# Altium schematic sheet 08_Power_Supply.SchDoc
size A; SheetNumber: 8; SheetTotal: 8
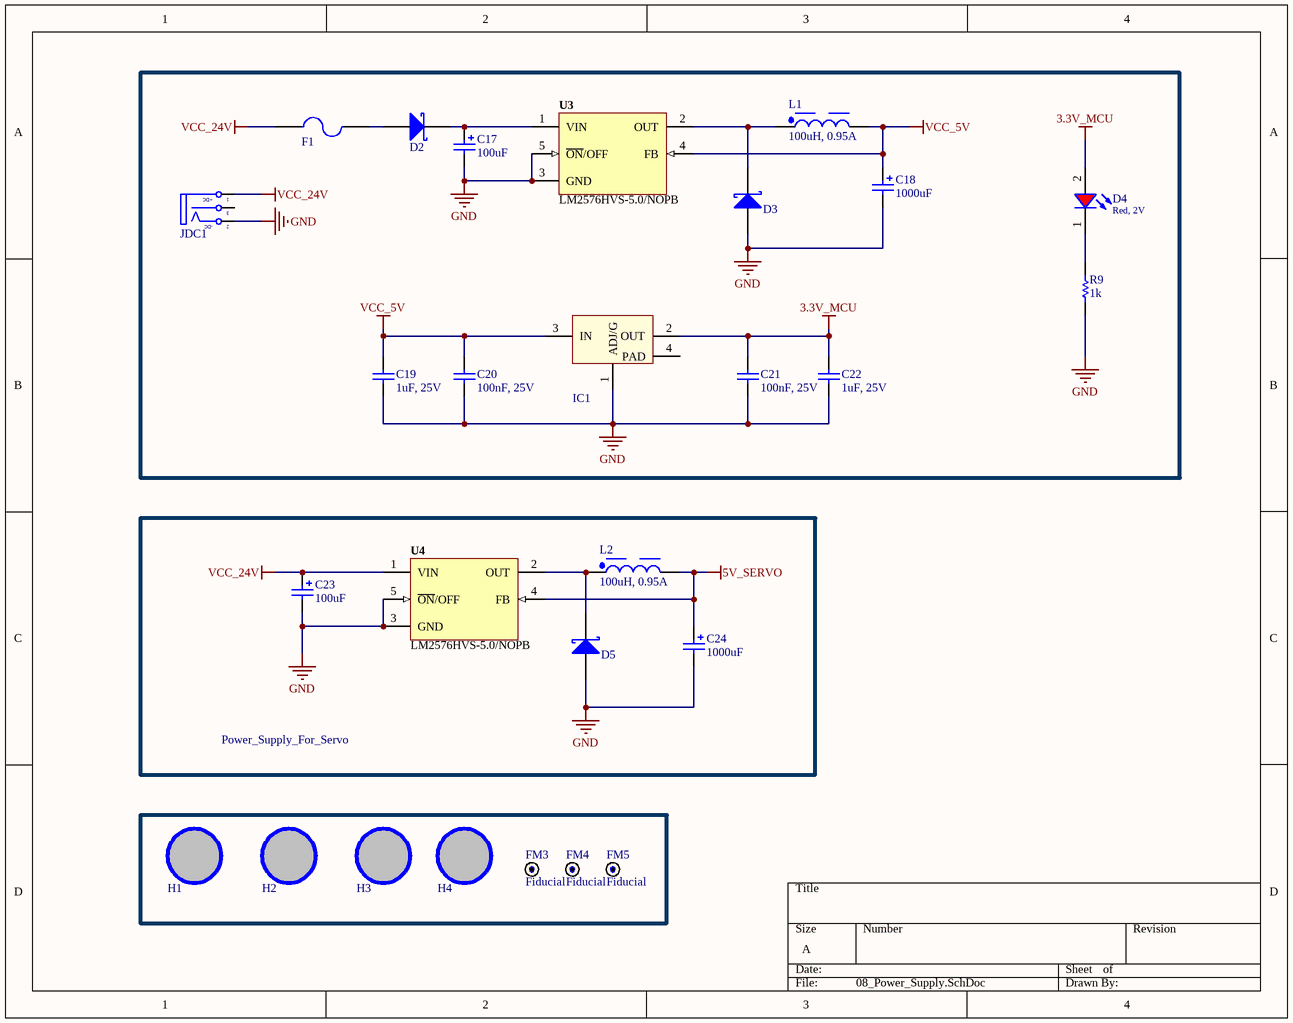
[diagram p0: 08_Power_Supply.SchDoc]

## Parts
C17  100uF  [WCAP-ATG8_D6.3H11]
C18  1000uF  [WCAP-ATG8_D10H20]
C19  1uF, 25V  [WCAP-CSGP_0603_H=0.8mm_Reflow]
C20  100nF, 25V  [WCAP-CSGP_0603_H=0.8mm_Reflow]
C21  100nF, 25V  [WCAP-CSGP_0603_H=0.8mm_Reflow]
C22  1uF, 25V  [WCAP-CSGP_0603_H=0.8mm_Reflow]
C23  100uF  [WCAP-ATG8_D6.3H11]
C24  1000uF  [WCAP-ATG8_D10H20]
D2  SS34  [SS34]  (value not drawn)
D3  SS34  [SS34]  (value not drawn)
D4  Red, 2V  [WL-SMCW_0603_H=0.7mm]
D5  SS34  [SS34]  (value not drawn)
F1  0ZCG0150BF2C  [FUSE SMD]  (value not drawn)
FM3  Fiducial  [FUDICIAL_MARKER]  (no BOM)
FM4  Fiducial  [FUDICIAL_MARKER]  (no BOM)
FM5  Fiducial  [FUDICIAL_MARKER]  (no BOM)
H1  Hole  [LO KHOAN 3MM]  (value not drawn)  (no BOM)
H2  Hole  [LO KHOAN 3MM]  (value not drawn)  (no BOM)
H3  Hole  [LO KHOAN 3MM]  (value not drawn)  (no BOM)
H4  Hole  [LO KHOAN 3MM]  (value not drawn)  (no BOM)
IC1  LM1117IMP-3.3/NOPB  [SOT223-4N]  (value not drawn)
JDC1  G-014-4  [DC-IN]  (value not drawn)
L1  100uH, 0.95A  [WE-PD2SR_7850]
L2  100uH, 0.95A  [WE-PD2SR_7850]
R9  value 1k  [RES-SM-0603]  (hidden comment: ESR03EZPJ102)
U3  LM2576HVS-5.0/NOPB  [TO263]
U4  LM2576HVS-5.0/NOPB  [TO263]

## Blocks framed on the sheet
Power_Supply_For_Servo: C23 C24 D5 L2 U4

## Nets
3.3V_MCU: C21.2 C22.2 D4.2(A) IC1.2(OUT)
5V_SERVO: C24.1(P) L2.2 U4.4(FB)
GND: C17.2(N) C18.2(N) C19.2 C20.1 C21.1 C22.1 C23.2(N) C24.2(N) D3.1(A) D5.1(A) IC1.1(ADJ/G) JDC1.2(TN) R9.1 U3.3(GND) U3.5(~{ON}/OFF) U4.3(GND) U4.5(~{ON}/OFF)
VCC_5V: C18.1(P) C19.1 C20.2 IC1.3(IN) L1.2 U3.4(FB)
VCC_24V: C23.1(P) F1.1 JDC1.1(T) U4.1(VIN)
NetC17_1: C17.1(P) D2.2(K) U3.1(VIN)
NetD2_1: D2.1(A) F1.2
NetD3_2: D3.2(K) L1.1 U3.2(OUT)
NetD4_1: D4.1(K) R9.2
NetD5_2: D5.2(K) L2.1 U4.2(OUT)

Not connected (* = marked no-connect by the designer): H1 1; H2 1; H3 1; H4 1; IC1 4(PAD); JDC1 3(S)

## Notes on the sheet
- (in symbol Jack DC) +DC; -DC

## Library data of the parts
C17 C23 = 860010473007: WCAP-ATG8 Aluminum Electrolytic Capacitor, Radial THT, D6.3xH11mm, 100uF, 25V; Manufacturer: Wurth Elektronik; Capacitance Tolerance: +/-20%; Dissipation Factor: 14%; Endurance: 2000h; Leakage Current: 25uA; Ripple Current: 209mA; Technical Reference: ATBD110101M025DSPA4B000; No. Pad (SMD): 0; No. Pad (THT): 2; ComponentLink1Description: Manufacturer Link; ComponentLink1URL: https://www.we-online.com/redexpert/article/860010473007?ad; ComponentLink2Description: Datasheet; ComponentLink2URL: https://www.we-online.com/redexpert/spec/860010473007?ad; Category: Aluminum Electrolytic Capacitors; Match Code: WCAP-ATG8; Manufacturer Part Number: 860010473007; Mount: Through Hole; Operating Temperature Max: 85°C; Operating Temperature Min: -40°C; Packaging: Ammo Pack; Height: 11mm; Diameter: 6.3mm; Capacitance: 100uF; Rated Voltage (DC): 25V; Unit Price (Digikey): 0.13
C18 C24 = 860010475017: WCAP-ATG8 Aluminum Electrolytic Capacitor, Radial THT, D10xH20mm, 1000uF, 25V; Manufacturer: Wurth Elektronik; Capacitance Tolerance: +/-20%; Dissipation Factor: 14%; Endurance: 2000h; Leakage Current: 250uA; Ripple Current: 1050mA; Technical Reference: ATBF200102M025DSPAAB000; No. Pad (SMD): 0; No. Pad (THT): 2; ComponentLink1Description: Manufacturer Link; ComponentLink1URL: https://www.we-online.com/redexpert/article/860010475017?ad; ComponentLink2Description: Datasheet; ComponentLink2URL: https://www.we-online.com/redexpert/spec/860010475017?ad; Category: Aluminum Electrolytic Capacitors; Match Code: WCAP-ATG8; Manufacturer Part Number: 860010475017; Mount: Through Hole; Operating Temperature Max: 85°C; Operating Temperature Min: -40°C; Packaging: Ammo Pack; Height: 20mm; Diameter: 10mm; Capacitance: 1000uF; Rated Voltage (DC): 25V; Unit Price (Digikey): 0.57
C19 C22 = 885012106022: WCAP-CSGP Multilayer Ceramic Chip Capacitor, General Purpose, size 0603, X5R, 1uF, 25V; Manufacturer: Wurth Elektronik; Rated Voltage: 25VDC; Isolation Resistance: >=0.5GOhm; Capacitance Tolerance: +/-20%; Technical Reference: X5R0603105M025DFCT10000; No. Pad (SMD): 2; No. Pad (THT): 0; ComponentLink1Description: Manufacturer; ComponentLink1URL: http://www.we-online.de; ComponentLink2Description: Datasheet; ComponentLink2URL: https://www.we-online.com/catalog/datasheet/885012106022.pdf; Operating Temperature: -55 to +85degC; Packaging: Tape and Reel; Manufacturer Part Number: 885012106022; Published Date: May 2020; Ceramic Type: X5R; Dissipation Factor: =<10%; Height: 0.8mm; Mounting Technology: SMT; Size: 0603; Capacitance: 1uF; Unit Price (Digikey): 0.43
C20 C21 = 885012206071: WCAP-CSGP Multilayer Ceramic Chip Capacitor, General Purpose, size 0603, X7R, 100nF, 25V; Manufacturer: Wurth Elektronik; Rated Voltage: 25VDC; Isolation Resistance: >=5GOhm; Capacitance Tolerance: +/-10%; Technical Reference: X7R0603104K025DFCT10000; No. Pad (SMD): 2; No. Pad (THT): 0; ComponentLink1Description: Manufacturer; ComponentLink1URL: http://www.we-online.de; ComponentLink2Description: Datasheet; ComponentLink2URL: https://www.we-online.com/catalog/datasheet/885012206071.pdf; Operating Temperature: -55 to +125degC; Packaging: Tape and Reel; Manufacturer Part Number: 885012206071; Published Date: May 2020; Ceramic Type: X7R; Dissipation Factor: =<3.5%; Height: 0.8mm; Mounting Technology: SMT; Size: 0603; Capacitance: 100nF; Unit Price (Digikey): 0.1
D2 D3 D5 = D Schottky: DIODE SCHOTTKY 40V 3A SMC; Mfr: onsemi; No. Pad (SMD): 2; No. Pad (THT): 0; Voltage - Forward (Vf) (Max) @ If: 500 mV @ 3 A; Speed: Fast Recovery =< 500ns, > 200mA (Io); Current - Reverse Leakage @ Vr: 500 µA @ 40 V; Published: 8-Jun-2000; LatestRevisionDate: 17-Jul-2002; LatestRevisionNote: Re-released for DXP Platform.; PackageReference: SMB; Publisher: Altium Limited; PackageDescription: DO-214-AA/SMB; 2 C-Bend Leads; Body 5.3 x 3.6 mm, inc. leads (LxW); Code_JEDEC: DO-214-AA; Unit Price (Digikey): 0.65; Category: Discrete Semiconductor Products; Diode Type: Schottky; Voltage - DC Reverse (Vr) (Max): 40 V; Current - Average Rectified (Io): 3A; Mounting Type: Surface Mount; Package / Case: DO-214AB, SMC*; Supplier Device Package: SMC (DO-214AB); Operating Temperature - Junction: -55°C ~ 150°C; Base Product Number: SS34
D4 = 150060RS75000: WL-SMCW SMT Mono-color Chip LED Waterclear, size 0603, Red, 2V, 140deg; Chip Technology: AlInGaP; Dominant Wavelength typ.: 625nm; Luminous Intensity typ.: 250mcd; Peak Wavelength typ.: 630nm; No. Pad (SMD): 2; No. Pad (THT): 0; Viewing Angle: 140deg; ComponentLink1Description: Manufacturer; ComponentLink1URL: http://www.we-online.de; ComponentLink2URL: https://www.we-online.com/catalog/datasheet/150060RS75000.pdf; ComponentLink2Description: Datasheet; Forward Voltage typ.: 2V; Emitting Color: Red; Mounting Technology: SMT; Operating Temperature: -40 to +85degC; Published Date: December 2019; Part Number: 150060RS75000; Packaging: Tape and Reel; Size: 0603; Publisher: Wurth Elektronik; Unit Price (Digikey): 0.15
F1 = Fuse: Polymeric PTC Resettable Fuse 24V 1.5 A Ih Surface Mount 1812 (4532 Metric), Concave; Mfr: Bel Fuse Inc.; No. Pad (SMD): 2; No. Pad (THT): 0; Current - Max: 100 A; Current - Hold (Ih) (Max): 1.5 A; Current - Trip (It): 3 A; Time to Trip: 1.5 s; Resistance - Initial (Ri) (Min): 40 mOhms; Resistance - Post Trip (R1) (Max): 120 mOhms; Approval Agency: AEC-Q200, cURus, TUV; Unit Price (Digikey): 0.23; Category: Circuit Protection; Series: 0ZCG; Type: Polymeric; Voltage - Max: 24V; Operating Temperature: -40°C ~ 85°C; Ratings: AEC-Q200; Mounting Type: Surface Mount; Package / Case: 1812 (4532 Metric), Concave; Size / Dimension: 0.179" L x 0.128" W (4.55mm x 3.24mm); Thickness (Max): 0.061" (1.55mm); ComponentLink1Description: Digikey; ComponentLink1URL: https://www.digikey.com/en/products/detail/bel-fuse-inc/0ZCG0150BF2C/4156109?s=N4IgTCBcDaIAwC0DCBxOBGArHAQgMTCRAF0BfIA
H1-H4 = Hole: Hole 3mm
IC1 = LM1117: Linear Voltage Regulator IC Positive Fixed 1 Output 800mA SOT-223; Mfr: Texas Instruments; Value: LM317; No. Pad (SMD): 4; No. Pad (THT): 0; Number of Regulators: 1; Voltage - Input (Max): 15V; Voltage - Output (Min/Fixed): 3.3V; Voltage Dropout (Max): 1.2V @ 800mA; Current - Quiescent (Iq): 5 mA; Current - Supply (Max): 10 mA; PSRR: 75dB (120Hz); Protection Features: Over Current, Over Temperature; Unit Price (Digikey): 1.41; Category: Integrated Circuits (ICs); Output Configuration: Positive; Output Type: Fixed; Current - Output: 800mA; Operating Temperature: -40°C ~ 125°C; Mounting Type: Surface Mount; Package / Case: TO-261-4, TO-261AA; Supplier Device Package: SOT-223; Base Product Number: LM1117
JDC1 = Jack DC: DC POWER JACK, MATES TO 5.5 X 2.; Mfr: GlobTek, Inc.; Value: Jac DC; No. Pad (SMD): 0; No. Pad (THT): 3; Gender: Male; Industry Recognized Mating Diameter: 2.10mm ID (0.083"), 5.50mm OD (0.217"); Actual Diameter: 0.083" (2.10mm ID), 0.217" (5.50mm OD); Number of Positions/Contacts: 2 Conductors, 3 Contacts; Internal Switch(s): Single Switch; Shielding: Shielded; Voltage - Rated: 24VDC; Current Rating (Amps): 5 A; Unit Price (Digikey): 1.02; Category: Connectors, Interconnects; Connector Type: Jack; Mounting Type: Through Hole, Right Angle; Termination: Kinked Pin, Solder; Insulation Color: Black; Contact Material - Plating: Nickel; Housing Material: Polybutylene Terephthalate (PBT), Glass Filled; Contact Material: Brass
L1 L2 = 744787101: WE-PD2SR SMT Power Inductor, size 7850, 100uH, 0.95A, 467mOhm; Manufacturer: Wurth Elektronik; Self Resonant Frequency: 5MHz; DC Resistance typ.: 396mOhm; Saturation Current: 0.87A; No. Pad (SMD): 2; No. Pad (THT): 0; ComponentLink1Description: Manufacturer; ComponentLink1URL: http://www.we-online.de; ComponentLink2Description: Datasheet; ComponentLink2URL: https://www.we-online.com/catalog/datasheet/744787101.pdf; Mounting Technology: SMT; Operating Temperature: -40 to +125degC; Packaging: Tape and Reel; Height: 5mm; DC Resistance max.: 467mOhm; Inductance: 100uH; Manufacturer Part Number: 744787101; Rated Current: 0.95A; Size: 7850; Length: 7.8mm; Width: 7mm; Unit Price (Digikey): 1.95
R9 = RESISTOR SMD: RES SMD 1K OHM 5% 1/4W 0603; Mfr: Rohm Semiconductor; No. Pad (SMD): 2; No. Pad (THT): 0; Resistance: 1 kOhms; Power (Watts): 0.25W, 1/4W; Temperature Coefficient: ±200ppm/°C; Unit Price (Digikey): 0.14; Series: ESR; Tolerance: ±5%; Composition: Thick Film; Features: Automotive AEC-Q200, Pulse Withstanding; ComponentLink1Description: Digikey; ComponentLink1URL: https://www.digikey.com/en/products/detail/rohm-semiconductor/ESR03EZPJ102/1762721?s=N4IgTCBcDaIKIGUBKAGAzHAWgBQFIEYUIBdAXyA; Operating Temperature: -55°C ~ 155°C; Package / Case: 0603 (1608 Metric); Supplier Device Package: 0603; Ratings: AEC-Q200; Size / Dimension: 0.063" L x 0.031" W (1.60mm x 0.80mm); Number of Terminations: 2; Height - Seated (Max): 0.022" (0.55mm)
U3 U4 = LM2576: IC REG BUCK 5V 3A TO263-5; Mfr: Texas Instruments; No. Pad (SMD): 6; No. Pad (THT): 0; Function: Step-Down; Output Configuration: Positive; Output Type: Fixed; Number of Outputs: 1; Voltage - Input (Min): 4V; Voltage - Input (Max): 60V; Frequency - Switching: 52kHz; Synchronous Rectifier: No; Category: IC-Power; Unit Price (Digikey): 9.24; Series: SIMPLE SWITCHER®; Topology: Buck; Voltage - Output (Min/Fixed): 5V; Current - Output: 3A; Operating Temperature: -40°C ~ 125°C (TJ); Mounting Type: Surface Mount; Package / Case: TO-263-6, D²Pak (5 Leads + Tab), TO-263BA; Supplier Device Package: DDPAK/TO-263-5; Base Product Number: LM2576
  U3: ComponentLink1Description: New link; ComponentLink1URL: *